# Altium schematic sheet VECTOR.SchDoc
size A4
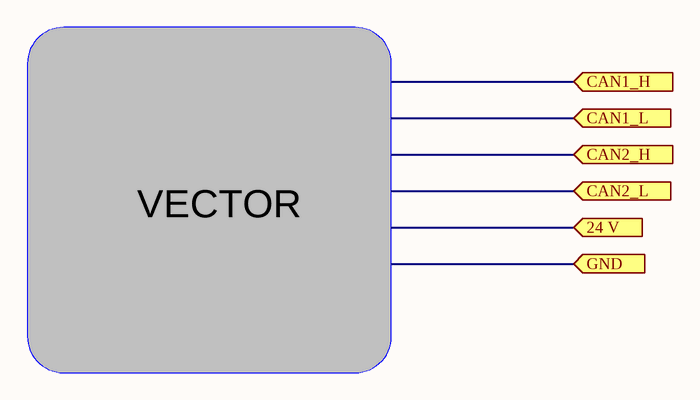
[diagram p0: VECTOR.SchDoc]

## Ports
24 V (in), CAN1_H (in), CAN1_L (in), CAN2_H (in), CAN2_L (in), GND (in)

## Notes on the sheet
- VECTOR